# EAGLE schematic Inverter 3 Phase MC3PHAC (EAGLE 9.5.0)
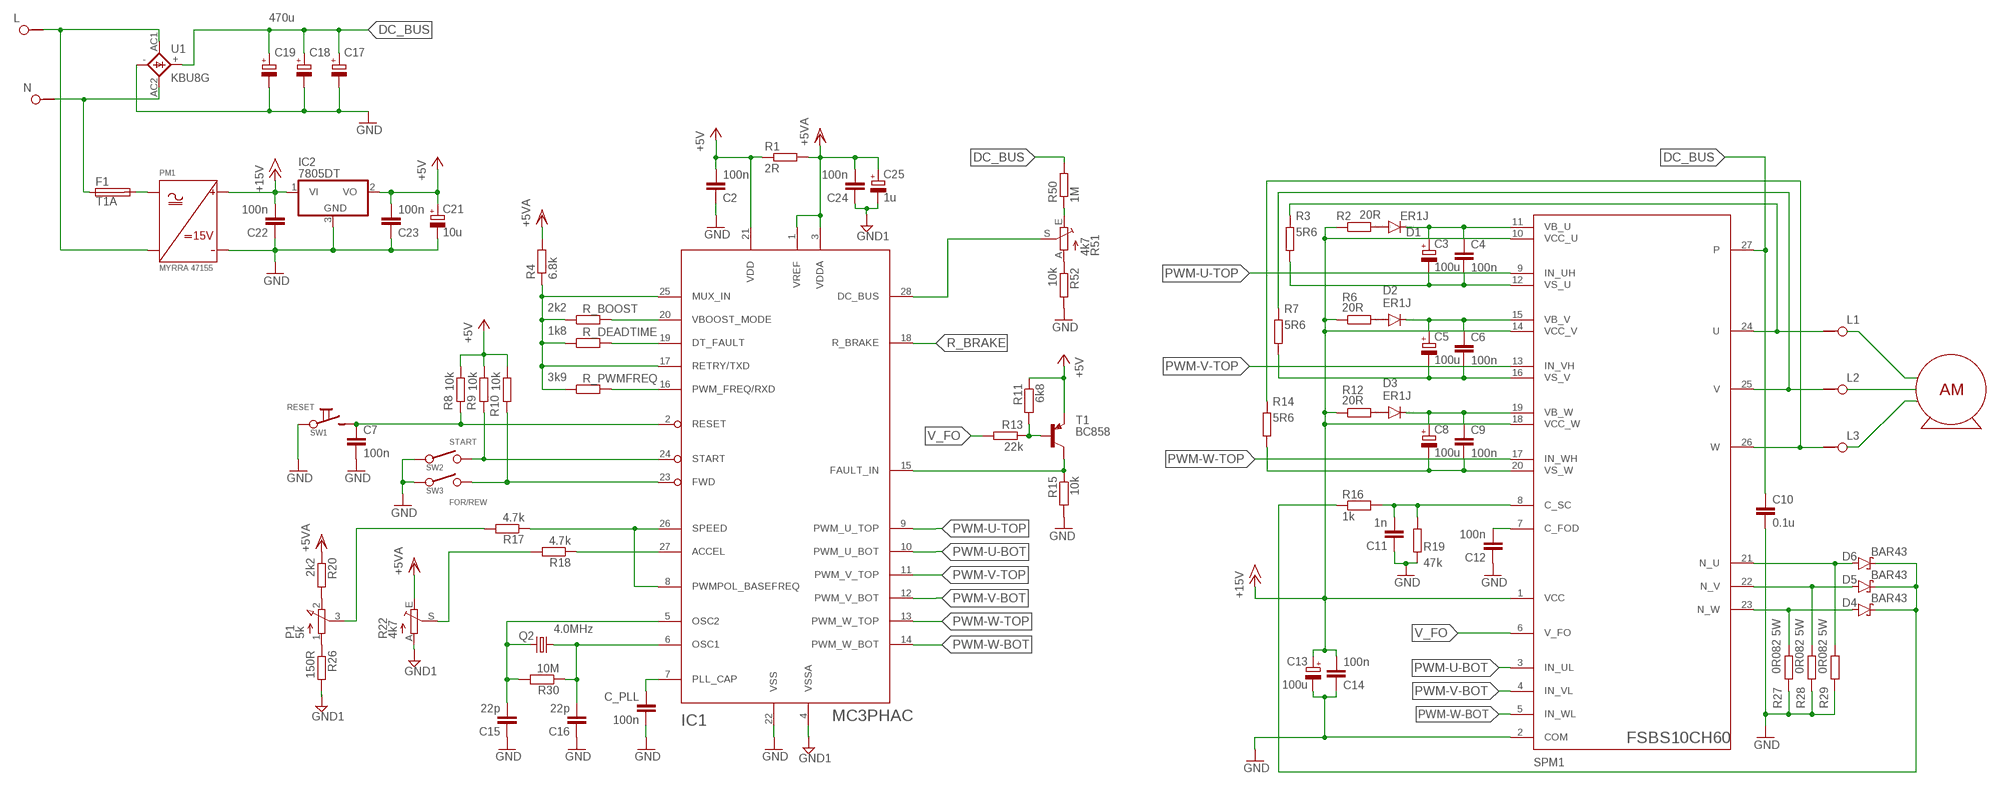
[diagram p0: schematic, sheet 1]

## Parts
C2  100n  C-EUC0805  [C0805]
C3  100u  CPOL-EUE2.5-7  [E2,5-7]
C4  100n  C-EUC0805  [C0805]
C5  100u  CPOL-EUE2.5-7  [E2,5-7]
C6  100n  C-EUC0805  [C0805]
C7  100n  C-EUC0805  [C0805]
C8  100u  CPOL-EUE2.5-7  [E2,5-7]
C9  100n  C-EUC0805  [C0805]
C10  0.1u  C-EU225-074X268  [C225-074X268]
C11  1n  C-EUC0805  [C0805]
C12  100n  C-EUC0805  [C0805]
C13  100u  CPOL-EUE2.5-7  [E2,5-7]
C14  100n  C-EUC0805  [C0805]
C15  22p  C-EUC0805  [C0805]
C16  22p  C-EUC0805  [C0805]
C17  470u  CPOL-EUE10-35  [EB35D]
C18  470u  CPOL-EUE10-35  [EB35D]
C19  470u  CPOL-EUE10-35  [EB35D]
C21  10u  CPOL-EUE2.5-7  [E2,5-7]
C22  100n  C-EUC0805  [C0805]
C23  100n  C-EUC0805  [C0805]
C24  100n  C-EUC0805  [C0805]
C25  1u  CPOL-EUE2.5-7  [E2,5-7]
C_PLL  100n  C-EUC0805  [C0805]
D1  ER1J  DIODE-DO214AC  [DO214AC]
D2  ER1J  DIODE-DO214AC  [DO214AC]
D3  ER1J  DIODE-DO214AC  [DO214AC]
D4  BAR43  BAT54  [SOT23]
D5  BAR43  BAT54  [SOT23]
D6  BAR43  BAT54  [SOT23]
F1  T1A  FUSESH22,5  [SH22,5]
IC1  MC3PHAC  [SO28W]
IC2  7805DT  [TO252]
L  L  W236-1  [W236-1]
L1  L1  W236-1  [W236-1]
L2  L2  W236-1  [W236-1]
L3  L3  W236-1  [W236-1]
N  N  W236-1  [W236-1]
P1  5k  POT  [1X03]
PM1  MYRRA 47155  MYRRA  [MYRRA]
Q2  4.0MHz  CRYSTALHC49U-V  [HC49U-V]
R1  2R  R-EU_R1206  [R1206]
R2  20R  R-EU_R1206  [R1206]
R3  5R6  R-EU_M1206  [M1206]
R4  6.8k  R-EU_R0805  [R0805]
R6  20R  R-EU_R1206  [R1206]
R7  5R6  R-EU_M1206  [M1206]
R8  10k  R-EU_R0805  [R0805]
R9  10k  R-EU_R0805  [R0805]
R10  10k  R-EU_R1206  [R1206]
R11  6k8  R-EU_R0805  [R0805]
R12  20R  R-EU_R1206  [R1206]
R13  22k  R-EU_R0805  [R0805]
R14  5R6  R-EU_M1206  [M1206]
R15  10k  R-EU_R0805  [R0805]
R16  1k  R-EU_R0805  [R0805]
R17  4.7k  R-EU_R0805  [R0805]
R18  4.7k  R-EU_R0805  [R0805]
R19  47k  R-EU_R0805  [R0805]
R20  2k2  R-EU_R0805  [R0805]
R22  4k7  TRIM_EU-CA9V  [CA9V]
R26  150R  R-EU_R0805  [R0805]
R27  0R082 5W  R-EU_WSC4527  [WSC4527]
R28  0R082 5W  R-EU_WSC4527  [WSC4527]
R29  0R082 5W  R-EU_WSC4527  [WSC4527]
R30  10M  R-EU_R0805  [R0805]
R50  1M  R-EU_0207/10  [0207/10]
R51  4k7  TRIM_EU-CA9V  [CA9V]
R52  10k  R-EU_R0805  [R0805]
R_BOOST  2k2  R-EU_R0805  [R0805]
R_DEADTIME  1k8  R-EU_R0805  [R0805]
R_PWMFREQ  3k9  R-EU_R0805  [R0805]
SPM1  FSBS10CH60  [SPM27-BA]
SW1  RESET  BUTTON  [1X02]
SW2  START  SWITCH  [1X02]
SW3  FOR/REW  SWITCH  [1X02]
T1  BC858  BC856B-PNP-SOT23-BEC  [SOT23-BEC]
U1  KBU8G  KBU  [KBU]

## Nets
+5V: C2.2 C21.+ C23.2 IC1.21(VDD) IC2.2(VO) R1.2 R8.1 R9.1 R10.1 R11.1 T1.E
+15V: C13.+ C14.2 C22.2 IC2.1(VI) PM1.7(+VOUT) R2.1 R6.1 R12.1 SPM1.1(VCC) SPM1.10(VCC_U) SPM1.14(VCC_V) SPM1.18(VCC_W)
DC_BUS: C10.1 C17.+ C18.+ C19.+ R50.2 SPM1.27(P) U1.+
GND: C2.1 C7.2 C10.2 C11.1 C12.1 C13.- C14.1 C15.1 C16.1 C17.- C18.- C19.- C21.- C22.1 C23.1 C_PLL.2 IC1.22(VSS) IC2.3(GND) PM1.9(-VOUT) R15.2 R19.2 R27.1 R28.1 R29.1 R52.2 SPM1.2(COM) SW1.1 SW2.1 SW3.1 U1.-
GND1: C24.1 C25.- IC1.4(VSSA) R22.A R26.2
N$1: C_PLL.1 IC1.7(PLL_CAP)
N$2: R18.2 R22.S
N$3: IC1.16(PWM_FREQ/RXD) R_PWMFREQ.2
N$4: IC1.19(DT_FAULT) R_DEADTIME.2
N$5: IC1.20(VBOOST_MODE) R_BOOST.2
N$6: IC1.17(RETRY/TXD) IC1.25(MUX_IN) R4.1 R_BOOST.1 R_DEADTIME.1 R_PWMFREQ.1
N$7: IC1.8(PWMPOL_BASEFREQ) IC1.26(SPEED) R17.1
N$8: P1.3(S) R17.2
N$9: C15.2 IC1.5(OSC2) Q2.2 R30.2
N$10: P1.2(E) R20.2
N$11: F1.1 N.1(KL1) U1.AC2
N$12: IC1.27(ACCEL) R18.1
N$13: IC1.24(START) R9.2 SW2.2
N$14: IC1.23(FWD) R10.2 SW3.2
N$15: C16.2 IC1.6(OSC1) Q2.1 R30.1
N$16: C7.1 IC1.2(RESET) R8.2 SW1.2
N$17: R50.1 R51.E
N$19: C5.- C6.2 R7.2 SPM1.16(VS_V)
N$20: F1.2 PM1.5(ACIN1)
N$24: L.1(KL1) PM1.1(ACIN2) U1.AC1
N$25: L1.1(KL1) R3.1 SPM1.24(U)
N$27: R51.A R52.1
N$29: L2.1(KL1) R7.1 SPM1.25(V)
N$30: L3.1(KL1) R14.1 SPM1.26(W)
N$46: C3.+ C4.1 D1.C SPM1.11(VB_U)
N$47: C3.- C4.2 R3.2 SPM1.12(VS_U)
N$48: D1.A R2.2
N$50: C11.2 R16.2 R19.1 SPM1.8(C_SC)
N$51: IC1.15(FAULT_IN) R15.1 T1.C
N$52: C12.2 SPM1.7(C_FOD)
N$53: C5.+ C6.1 D2.C SPM1.15(VB_V)
N$55: D2.A R6.2
N$56: C8.+ C9.1 D3.C SPM1.19(VB_W)
N$57: D3.A R12.2
N$59: C8.- C9.2 R14.2 SPM1.20(VS_W)
N$63: D4.1(A) R27.2 SPM1.23(N_W)
N$64: D5.1(A) R28.2 SPM1.22(N_V)
N$65: D6.1(A) R29.2 SPM1.21(N_U)
N$69: D4.3(C) D5.3(C) D6.3(C) R16.1
N$72: R11.2 R13.1 T1.B
N$77: P1.1(A) R26.1
N$79: IC1.28(DC_BUS) R51.S
PWM-U-BOT: IC1.10(PWM_U_BOT) SPM1.3(IN_UL)
PWM-U-TOP: IC1.9(PWM_U_TOP) SPM1.9(IN_UH)
PWM-V-BOT: IC1.12(PWM_V_BOT) SPM1.4(IN_VL)
PWM-V-TOP: IC1.11(PWM_V_TOP) SPM1.13(IN_VH)
PWM-W-BOT: IC1.14(PWM_W_BOT) SPM1.5(IN_WL)
PWM-W-TOP: IC1.13(PWM_W_TOP) SPM1.17(IN_WH)
R_BRAKE: IC1.18(R_BRAKE)
V_FO: R13.2 SPM1.6(V_FO)
VDD: C24.2 C25.+ IC1.1(VREF) IC1.3(VDDA) R1.1 R4.2 R20.1 R22.E ; supply symbol labelled +5VA
Unconnected: L1.2(KL2) L2.2(KL2) L3.2(KL2) L.2(KL2) N.2(KL2)

## Library data of the parts
C2 C4 C6 C7 C9-C12 C14-C16 C22-C24 C_PLL = rcl:C-EU: CAPACITOR, European symbol; SPICEPREFIX: C
C3 C5 C8 C13 C17-C19 C21 C25 = rcl:CPOL-EU: POLARIZED CAPACITOR, European symbol; SPICEPREFIX: C
D1-D3 = diode:DIODE-: DIODE
D4-D6 = diode:BAT54: Schottky Diodes Source: Fairchild .. BAT54.pdf
F1 = fuse:FUSE: Fuse; OC_FARNELL: unknown; OC_NEWARK: unknown
IC1 = Menic:MC3PHAC
IC2 = linear:78*: Positive VOLTAGE REGULATOR Source: http://cache.national.com/ds/LM/LM78L05.pdf http://www.fairchildsemi.com/ds/LM/LM7805.pdf
L L1-L3 N = con-wago-508:W236-1: WAGO SREW CLAMP; OC_FARNELL: unknown; OC_NEWARK: unknown
P1 = Menic:POT: 16mm Potentiometer one level Source: http://www.alphapotentiometers.net/html/16mm_pot_2.html
PM1 = Menic:MYRRA
Q2 = crystal:CRYSTAL: CRYSTAL; OC_FARNELL: 1666969; OC_NEWARK: unknown
R1-R4 R6-R20 R26-R30 R50 R52 R_BOOST R_DEADTIME R_PWMFREQ = rcl:R-EU_: RESISTOR, European symbol; SPICEPREFIX: R
R22 R51 = pot:TRIM_EU-: POTENTIOMETER
SPM1 = Menic:FSBS10CH60
SW1 = Menic:BUTTON
SW2 SW3 = Menic:SWITCH
T1 = transistor:*-PNP-: PNP Transistror
U1 = Menic:KBU: DIOTEC RECTIFIER